# EasyEDA Pro project ProPrj_Loongson_Aquarii_v1.7.epro, board PCB1
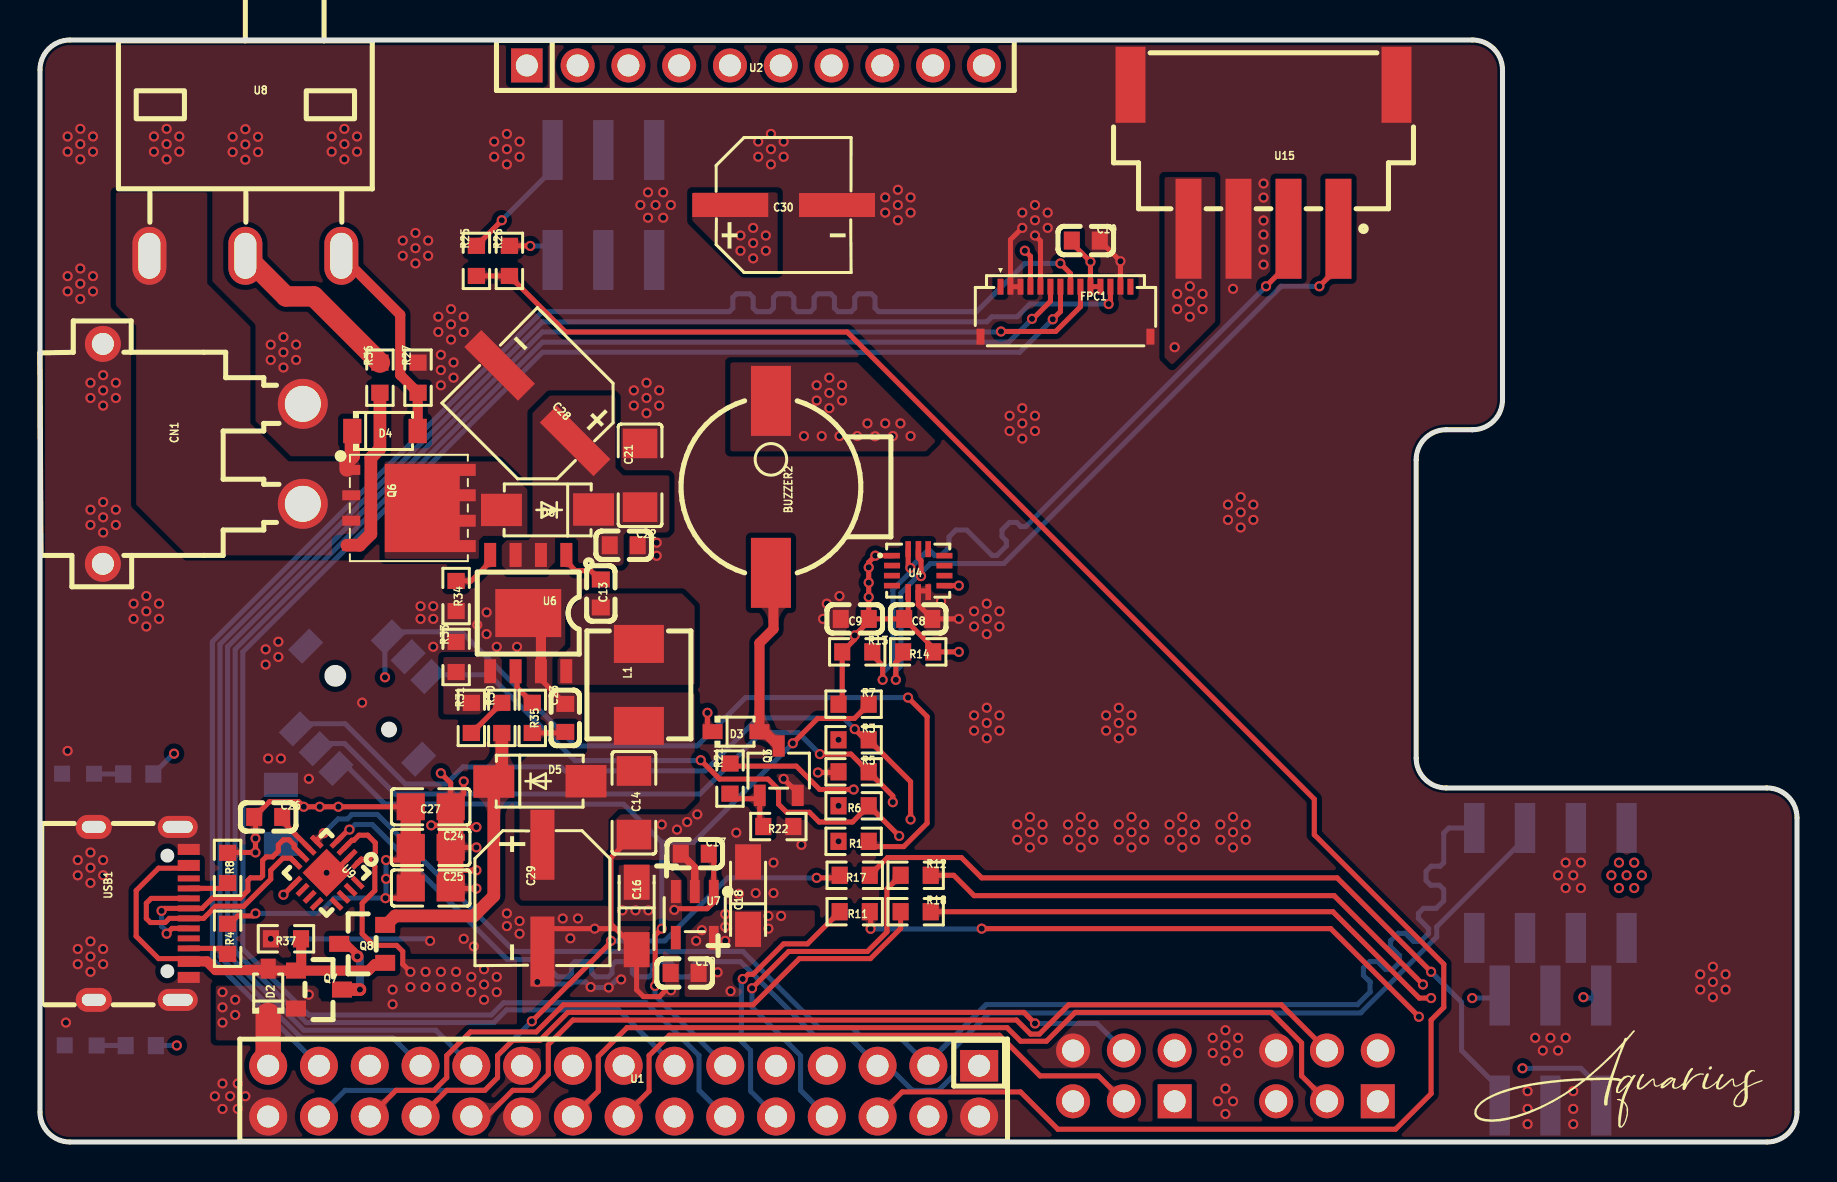
[diagram p2: board, top side]
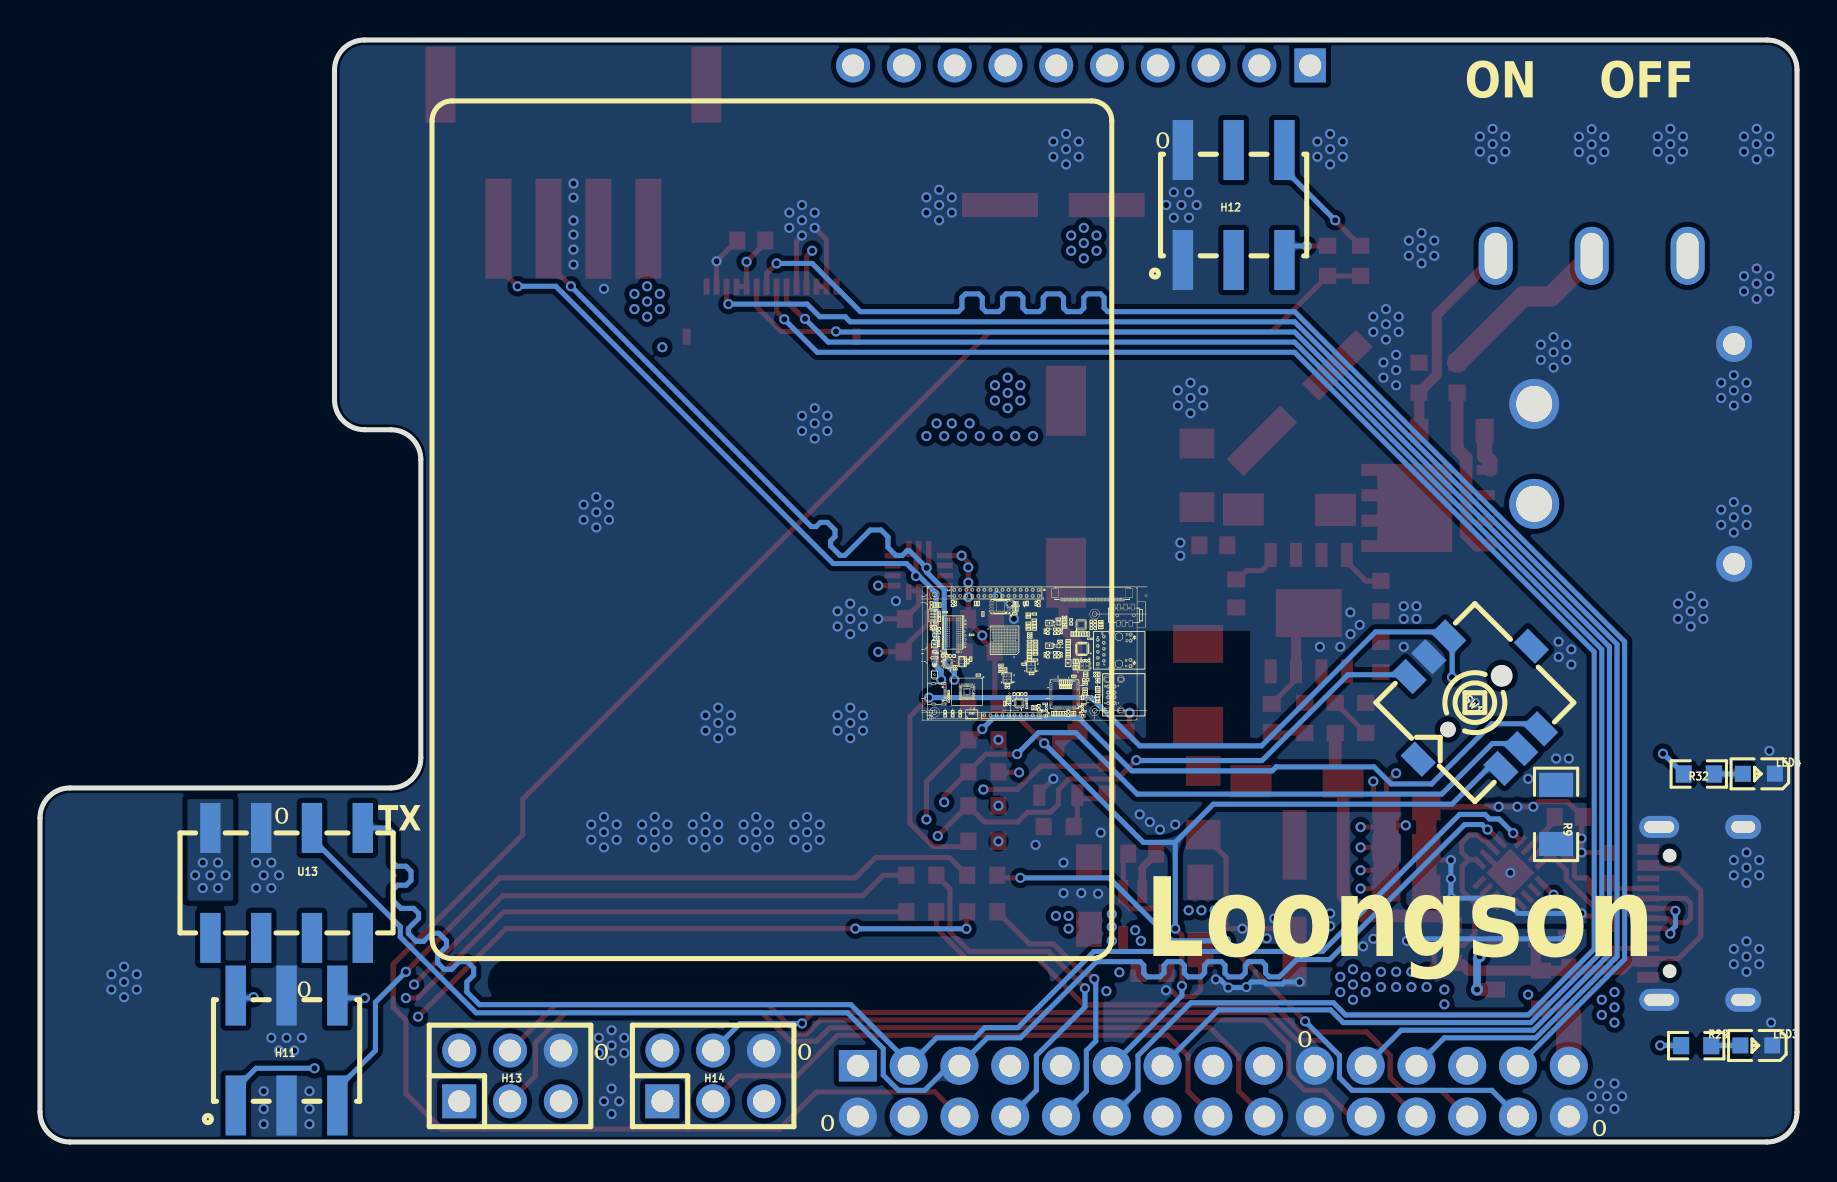
[diagram p3: board, bottom side, seen from below]

Outline 87.88 x 55.12 mm; copper layers: Top Layer, VCC, GND, Bottom Layer. Coordinates in mm from the lower left corner of the outline.
Outline path: 0,53.62 0,1.5 arc(0.44,0.44) 1.5,0 86.38,0 arc(87.44,0.44) 87.88,1.5 87.88,16.21 arc(87.44,17.27) 86.38,17.71 70.33,17.71 arc(69.27,18.15) 68.83,19.21 68.83,34.13 arc(69.27,35.19) 70.33,35.63 71.65,35.63 arc(72.71,36.07) 73.15,37.13 73.15,53.62 arc(72.71,54.68) 71.65,55.12 1.5,55.12 arc(0.44,54.68) 0,53.62
Stack: Top Layer 0.035mm 外层铜厚1oz / Dielectric1 0.2104mm 7628 RC49% 8.6mil / VCC 0.0152mm 内层铜厚 / Dielectric2 1.065mm 1.1mm H/HOZ Copper / GND 0.0152mm 内层铜厚 / Dielectric3 0.2104mm 7628 RC49% 8.6mil / Bottom Layer 0.035mm 外层铜厚1oz

## Design rules (mm)
net TX: DP2
net RX: DP2
net I2C_SCL: DP4
net I2C_SDA: DP4
net TFT180_SCL: DP3
net TFFT180_SDA: DP3
net UD+: DP1
net UD-: DP1
template: 自定义配置
spacing copperThickness1oz (default): track to track 0.102, other pairs 0.152 to 0.3
spacing copperThickness2oz: track to track 0.203, other pairs 0.152 to 0.3
track width copperThickness1oz (default): min 0.127, default 0.254, max 2.54
track width copperThickness2oz: min 0.203, default 0.254, max 2.54
differential pair differentialPair (default): width min 0.127, default 0.254, max 2.54; gap min 0.152, default 0.152
via viaSize (default): diameter min 0.5, default 0.61, max 10; hole min 0.3, default 0.305, max 6.3

## Placement (name value [footprint] x y rotation side)
BUZZER2  2.7kHz  [BUZ-SMD_GSC9032RB]  36.56 32.77 90 top
C8  10nF  [C0603]  43.93 26.17 0 top
C9  10nF  [C0603]  40.75 26.17 0 top
C10  100nF  [C0603]  52.31 45.09 180 top
C13  100nF  [C0603]  28.05 27.44 90 top
C14  47uF  [C1206]  29.71 16.97 90 top
C16  10uF  [CAP-SMD_L3.2-W1.6-RD-C7171]  29.84 11.31 270 top
C17  100nF  [C0603]  32.75 14.42 180 top
C18  10uF  [CAP-SMD_L3.2-W1.6-RD-C7171]  35.42 12.32 90 top
C19  100nF  [C0603]  32.24 8.45 180 top
C21  4.7uF  [C1206]  30.02 33.35 270 top
C22  100nF  [C0603]  29.2 29.85 180 top
C23  4.7nF  [C0603]  26.27 21.21 270 top
C24  1uF  [C0805]  19.54 14.74 180 top
C25  1uF  [C0805]  19.54 12.7 180 top
C26  100nF  [C0603]  11.41 16.26 180 top
C27  1uF  [C0805]  19.54 16.77 0 top
C28  100uF  [CAP-SMD_BD6.3-L6.6-W6.6-FD-1]  24.88 36.96 135 top
C29  220uF  [CAP-SMD_BD6.3-L6.6-W6.6-LS7.3-FD-H7.7]  25.13 12.2 270 top
C30  100uF  [CAP-SMD_BD6.3-L6.6-W6.6-FD-1]  37.2 46.87 0 top
CN1  XT30PW-M30.G.Y  [CONN-TH_XT30PW-M]  8.15 34.42 270 top
D2  1N5819WS  [SOD-323_L1.8-W1.3-LS2.5-RD]  11.41 7.5 90 top
D3  1N5819WS  [SOD-323_L1.8-W1.3-LS2.5-RD]  34.81 20.53 0 top
D4  BZT52C16  [SOD-123_L2.7-W1.6-LS3.7-RD]  17.26 35.56 0 top
D5  SS54  [SMA_L4.3-W2.6-LS5.0-FD]  25 18.04 180 top
D6  SS54  [SMA_L4.3-W2.6-LS5.0-FD]  25.39 31.63 0 top
FPC1  HC-FPC-05-09-14RLTAG  [FPC-SMD_14P-P0.50_HC-FPC-05-09-14RLTAG]  51.29 41.53 180 top
H11  HX PZ2.54-2x3P TP  [HDR-SMD_6P-P2.54-V-M-R2-C3-LS7.2_M20-8760342]  75.55 4.58 180 bottom
H12  HX PZ2.54-2x3P TP  [HDR-SMD_6P-P2.54-V-M-R2-C3-LS7.2_M20-8760342]  28.18 46.87 180 bottom
H13  PZ254V-12-6P  [HDR-TH_6P-P2.54-V-M-R2-C3-S2.54]  64.37 3.31 180 bottom
H14  PZ254V-12-6P  [HDR-TH_6P-P2.54-V-M-R2-C3-S2.54]  54.21 3.31 180 bottom
L1  4.7uH  [IND-SMD_L5.4-W5.2_FXL0530]  29.96 22.86 270 top
LED3  NCD0603R1  [LED0603-RD_RED]  2.03 4.83 0 bottom
LED4  NCD0603R1  [LED0603-RD_RED]  1.91 18.42 0 bottom
Q3  S8050  [SOT-23-3_L2.9-W1.6-P1.90-LS2.8-BR]  36.95 18.58 270 top
Q6  CJAC70P06  [TDSON-8_L5.9-W5.2-P1.27-BL]  17.34 31.71 270 top
Q7  AO3401A  [SOT-23_L2.9-W1.3-P1.90-LS2.4-BR]  13.95 7.62 180 top
Q8  AO3401A  [SOT-23_L2.9-W1.3-P1.90-LS2.4-BR]  16.11 9.91 0 top
R1  10kΩ  [R0603]  40.7 15.04 0 top
R3  10kΩ  [R0603]  40.7 20.12 180 top
R4  5.1kΩ  [R0603]  9.38 10.16 90 top
R5  10kΩ  [R0603]  40.7 18.52 180 top
R6  10kΩ  [R0603]  40.7 16.82 0 top
R7  10kΩ  [R0603]  40.7 21.9 180 top
R8  5.1kΩ  [R0603]  9.38 13.71 90 top
R9  0Ω  [R1206]  12.05 16.39 90 bottom
R11  100Ω  [R0603]  40.75 11.52 0 top
R12  100Ω  [R0603]  43.8 13.34 180 top
R13  5.1kΩ  [R0603]  40.88 24.52 180 top
R14  5.1kΩ  [R0603]  43.93 24.52 0 top
R17  100Ω  [R0603]  40.75 13.34 0 top
R18  100Ω  [R0603]  43.8 11.52 180 top
R21  1kΩ  [R0603]  34.51 18.18 270 top
R22  10kΩ  [R0603]  36.93 15.78 0 top
R25  100Ω  [R0603]  21.83 44.07 270 top
R26  100Ω  [R0603]  23.48 44.07 270 top
R27  10kΩ  [R0603]  18.91 38.23 270 top
R29  4.7kΩ  [R0603]  5.04 4.82 0 bottom
R30  51kΩ  [R0603]  23.1 21.21 270 top
R31  1.5kΩ  [R0603]  21.57 21.21 270 top
R32  2.7kΩ  [R0603]  4.91 18.41 180 bottom
R33  10kΩ  [R0603]  20.81 24.26 270 top
R34  200kΩ  [R0603]  20.81 27.31 90 top
R35  20kΩ  [R0603]  24.62 21.21 90 top
R36  10Ω  [R0603]  17 38.23 270 top
R37  10kΩ  [R0603]  12.3 10.16 0 top
SW1  7*7*5-6P-L WX  [SW-SMD_8P-L7.0-W7.0-P1.40-LS7.4-TL]  16.11 21.98 225 bottom
U1  2541FV-2x15P-B  [HDR-TH_30P-P2.54-V-F-R2-C15-S2.54]  29.2 2.54 180 top
U2  PM2.54-1*10  [HDR-TH_10P-P2.54-V-F]  35.78 53.85 0 top
U4  ICM-42688P-HXY  [LGA-14_L3.0-W2.5-P0.50-TL]  43.93 28.58 0 top
U6  SCT2450STER  [ESOP-8_L4.9-W3.9-P1.27-LS6.0-BL-EP]  24.42 26.46 180 top
U7  RT9013-33GB  [SOT-23-5_L3.0-W1.7-P0.95-LS2.8-BL]  32.75 11.37 180 top
U8  SS12D10G6-WJ  [SW-TH_3P-P4.80_HX-SS12D10G6-WJ]  10.27 44.33 180 top
U9  CH343P  [TQFN-16_L3.0-W3.0-P0.50-BL-EP1.7]  14.34 13.47 135 top
U13  5BME8-08872-204-W0  [CONN-SMD_5BME8-08872-204-W0]  75.55 12.96 0 bottom
U15  2.54-4PWTDK  [CONN-SMD_4P-P2.50_SHOU_2.54-4PWTDK]  61.2 49.28 180 top
USB1  TYPE-C 16PIN 2MD(073)  [USB-C-SMD_TYPE-C-6PIN-2MD-073]  5.06 11.44 270 top

## Footprints (pads in the part's own frame, mm; a bottom-side part is the same pattern mirrored in y, then rotated)
BUZ-SMD_GSC9032RB
  rect 3.5x2 smd: 1(4.3,0) 2(-4.3,0)
C0603
  rect 0.8x0.9 smd: 1(-0.7,0) 2(0.7,0)
C0805
  rect 1.41x1.35 smd: 1(-1,0) 2(1,0)
C1206
  rect 1.485x1.728 smd: 1(-1.593,0) 2(1.593,0)
CAP-SMD_BD6.3-L6.6-W6.6-FD-1
  rect 3.8x1.2 smd: 1(-2.67,0) 2(2.67,0)
CAP-SMD_BD6.3-L6.6-W6.6-LS7.3-FD-H7.7
  rect 3.5x1.2 smd: 1(-2.67,0) 2(2.67,0)
CAP-SMD_L3.2-W1.6-RD-C7171
  rect 1.758x1.296 smd: 1(-1.687,0) 2(1.687,0)
CONN-SMD_4P-P2.50_SHOU_2.54-4PWTDK
  rect 1.3x5 smd: 1(-3.75,3.6) 2(-1.25,3.6) 3(1.25,3.6) 4(3.75,3.6)
  rect 1.5x3.8 smd: 5(6.65,-3.6) 6(-6.65,-3.6)
CONN-SMD_5BME8-08872-204-W0
  rect 1.02x2.5 smd: 1(-3.81,-2.75) 2(-3.81,2.75) 3(-1.27,-2.75) 4(-1.27,2.75) 5(1.27,-2.75) 6(1.27,2.75) 7(3.81,-2.75) 8(3.81,2.75)
CONN-TH_XT30PW-M
  round 2.5 hole 1.8: 1(-2.5,5) 2(2.5,5)
  round 1.8 hole 1.1: 3(5.5,-5) 4(-5.5,-5)
ESOP-8_L4.9-W3.9-P1.27-LS6.0-BL-EP
  rect 0.6x1.2 smd: 1(-1.905,-2.909) 2(-0.635,-2.909) 3(0.635,-2.909) 4(1.905,-2.909) 5(1.905,2.909) 6(0.635,2.909) 7(-0.635,2.909) 8(-1.905,2.909)
  rect 3.3x2.4 smd: 9(0,0)
FPC-SMD_14P-P0.50_HC-FPC-05-09-14RLTAG
  rect 0.3x0.8 smd: 1(3.25,-1.25) 2(2.75,-1.25) 3(2.25,-1.25) 4(1.75,-1.25) 5(1.25,-1.25) 6(0.75,-1.25) 7(0.25,-1.25) 8(-0.25,-1.25) 9(-0.75,-1.25) 10(-1.25,-1.25) 11(-1.75,-1.25) 12(-2.25,-1.25) 13(-2.75,-1.25) 14(-3.25,-1.25)
  rect 0.4x0.8 smd: 15(-4.25,1.25) 16(4.25,1.25)
HDR-SMD_6P-P2.54-V-M-R2-C3-LS7.2_M20-8760342
  rect 1.02x3 smd: 1(-2.54,-2.75) 2(-2.54,2.75) 3(0,-2.75) 4(0,2.75) 5(2.54,-2.75) 6(2.54,2.75)
HDR-TH_6P-P2.54-V-M-R2-C3-S2.54
  rect 1.7x1.7 hole 1.1: 1(-2.54,-1.27)
  round 1.7 hole 1.1: 2(-2.54,1.27) 3(0,-1.27) 4(0,1.27) 5(2.54,-1.27) 6(2.54,1.27)
HDR-TH_10P-P2.54-V-F
  rect 1.575x1.7 hole 1.1: 1(-11.43,0)
  round 1.7 hole 1.1: 2(-8.89,0) 3(-6.35,0) 4(-3.81,0) 5(-1.27,0) 6(1.27,0) 7(3.81,0) 8(6.35,0) 9(8.89,0) 10(11.43,0)
HDR-TH_30P-P2.54-V-F-R2-C15-S2.54
  rect 1.9x1.575 hole 1.1: 1(-17.78,-1.27)
  round 1.9 hole 1.1: 2(-17.78,1.27) 3(-15.24,-1.27) 4(-15.24,1.27) 5(-12.7,-1.27) 6(-12.7,1.27) 7(-10.16,-1.27) 8(-10.16,1.27) 9(-7.62,-1.27) 10(-7.62,1.27) 11(-5.08,-1.27) 12(-5.08,1.27) 13(-2.54,-1.27) 14(-2.54,1.27) 15(0,-1.27) 16(0,1.27) 17(2.54,-1.27) 18(2.54,1.27) 19(5.08,-1.27) 20(5.08,1.27) 21(7.62,-1.27) 22(7.62,1.27) 23(10.16,-1.27) 24(10.16,1.27) 25(12.7,-1.27) 26(12.7,1.27) 27(15.24,-1.27) 28(15.24,1.27) 29(17.78,-1.27) 30(17.78,1.27)
IND-SMD_L5.4-W5.2_FXL0530
  rect 1.9x2.5 smd: 1(-2.05,0) 2(2.05,0)
LED0603-RD_RED
  rect 0.8x0.8 smd: 1(-0.799,-0.004) 2(0.799,0.004)
LGA-14_L3.0-W2.5-P0.50-TL
  rect 0.8x0.28 smd: 1(-1.313,0.75) 2(-1.308,0.254) 3(-1.313,-0.25) 4(-1.313,-0.75) 8(1.313,-0.75) 9(1.313,-0.25) 10(1.313,0.25) 11(1.313,0.75)
  rect 0.28x0.8 smd: 5(-0.5,-1.076) 6(0,-1.079) 7(0.5,-1.076) 12(0.5,1.076) 13(0.013,1.079) 14(-0.5,1.076)
R0603
  rect 0.806x0.864 smd: 1(-0.753,0) 2(0.753,0)
R1206
  rect 1.208x1.701 smd: 1(-1.479,0) 2(1.479,0)
SMA_L4.3-W2.6-LS5.0-FD
  rect 2.046x1.62 smd: 1(-2.304,-0.009) 2(2.304,0.009)
SOD-123_L2.7-W1.6-LS3.7-RD
  rect 0.91x1.22 smd: 1(-1.635,0) 2(1.635,0)
SOD-323_L1.8-W1.3-LS2.5-RD
  rect 1x0.75 smd: 1(-1.173,0) 2(1.173,0)
SOT-23-3_L2.9-W1.6-P1.90-LS2.8-BR
  rect 1.07x0.6 smd: 1(1.235,-0.95) 2(1.235,0.95) 3(-1.235,0)
SOT-23-5_L3.0-W1.7-P0.95-LS2.8-BL
  rect 0.49x1.157 smd: 1(-0.95,-1.153) 2(0,-1.153) 3(0.95,-1.153)
  rect 0.49x1.175 smd: 4(0.95,1.153) 5(-0.95,1.153)
SOT-23_L2.9-W1.3-P1.90-LS2.4-BR
  rect 1x0.8 smd: 1(1.15,-0.95) 2(1.15,0.95) 3(-1.15,0)
SW-SMD_8P-L7.0-W7.0-P1.40-LS7.4-TL
  rect 1.5x1 smd: 1(-3.25,1.4) 2(-3.25,0) 3(-3.25,-1.4) 4(3.25,-1.4) 5(3.25,0) 6(3.25,1.4) 7(0,4) 8(0,-4)
SW-TH_3P-P4.80_HX-SS12D10G6-WJ
  oval 1.7x2.9 hole 1.1x2.3: 1(-4.8,0) 2(0,0) 3(4.8,0)
TDSON-8_L5.9-W5.2-P1.27-BL
  rect 0.5x0.9 smd: 1(-1.905,-1.775) 2(-0.635,-1.775) 3(0.635,-1.775) 4(1.905,-1.775)
  custom 4.41x4.55 smd: 5(0,1.775)
TQFN-16_L3.0-W3.0-P0.50-BL-EP1.7
  rect 0.25x0.75 smd: 1(-0.749,-1.45) 2(-0.248,-1.45) 3(0.252,-1.45) 4(0.751,-1.45) 9(0.75,1.45) 10(0.25,1.45) 11(-0.25,1.45) 12(-0.749,1.45)
  rect 0.75x0.25 smd: 5(1.45,-0.75) 6(1.45,-0.25) 7(1.45,0.25) 8(1.45,0.75) 13(-1.45,0.75) 14(-1.45,0.25) 15(-1.45,-0.25) 16(-1.45,-0.75)
  rect 1.7x1.7 smd: 17(0.001,0)
USB-C-SMD_TYPE-C-6PIN-2MD-073
  rect 0.55x1.1 smd: 1(-3.2,2.375) 2(-2.4,2.375) 11(2.4,2.375) 12(3.2,2.375)
  rect 0.3x1.1 smd: 3(-1.75,2.375) 4(-1.25,2.375) 5(-0.75,2.375) 6(-0.25,2.375) 7(0.25,2.375) 8(0.75,2.375) 9(1.25,2.375) 10(1.75,2.375)
  oval 1.1x2 hole 0.6x1.5: 13(-4.325,1.825) 14(4.325,1.825)
  oval 1.2x1.8 hole 0.6x1.2: 13(-4.325,-2.375) 14(4.325,-2.375)

## Nets
As in the schematic.

Pads without a net: FPC1 1 14; H12 3 4; H13 1 2; H14 1 2; SW1 7 8; U1 1; U2 1 2 3 4 5 6 7 8 9 10; U4 2 3 4 9 10 11 12; U7 4; U9 10 11 12 13 14 15 16; U13 2 4 6 8; USB1 3 9

## Via types
v1: diameter 0.508, hole 0.305, Top Layer to Bottom Layer, 467 vias
v2: diameter 0.61, hole 0.305, Top Layer to Bottom Layer, 2 vias

## Routing (per net, layer and track width the routed paths; a pad name or vN(x,y) marks a point on that pad's centre or on a via; arc(x,y) is an arc through that point)
3V3: length 64.8
  Top Layer w0.254: v1(49.26,44.58) 49.54,44.3 FPC1.4 ; C8.1 44.68,24.71 R14.2 v1(45.96,24.52) ; C8.1 C9.2 ; C8.1 43.43,26.37 43.43,27.57 ; C10.2 51.61,44.96 v1(52.54,44.03) FPC1.10 FPC1.11 ; C9.2 41.45,26.04 v1(40.75,25.34) 40.75,25.14 R13.2 40.13,22.08 R7.2 ; C9.2 v1(41.45,27.26) v1(41.45,27.98) v1(41.45,28.74) 41.45,29 v1(41.78,29.33) 42.67,29.33 ; R5.2 39.91,18.48 v1(38.91,18.48) ; 45.19,27.83 v1(45.96,27.83)
  GND w0.254: v1(6.7,19.42) 6.7,22.85 11.8,27.94 40.72,27.94 41.45,27.22
  Bottom Layer w0.254: v1(6.7,19.42) 6.68,19.42 R32.1
  vias: v1(32.82,10.06) v1(33.11,10.6) v1(33.89,8.49) v1(34.27,11.4) v1(34.27,10.76) v1(34.27,10.06) v1(34.54,7.55) v1(36.43,11.31) v1(36.43,10.67) v1(37.07,11.31) v1(39.94,20.12) v1(39.94,16.82) v1(39.94,15.04) v1(56.75,39.76) v1(56.88,42.42) v1(56.88,41.66) v1(57.52,42.8) v1(57.52,42.04) v1(57.52,41.28) v1(58.15,42.42) v1(58.15,41.66)
+5V: length 35.2
  Top Layer w0.254: v1(18.53,8.51) 18.15,8.9 18.15,9.53 17.84,9.84 16.7,9.84 16.11,10.42 16.11,11.94 16.75,12.58 16.75,13.78 16.41,14.12 ; v1(21.19,18.04) 21.19,17.42 C27.2 20.54,17.95 v1(20.05,18.44) ; v1(31.73,11.61) 31.78,11.67 33.37,11.67 33.7,12 U7.1 33.7,14.17 33.45,14.42 ; C25.1 20.57,12.68 v1(21.83,12.68) ; v1(21.83,13.59) 20.54,13.59 ; D3.1 33.39,20.78 v1(33.39,21.47) ; 12.78,12.97 v1(12.18,12.37) 12.18,12.32 ; v1(21.83,14.74) C24.1 ; 20.54,15.87 20.52,15.84 v1(19.57,15.84) ; 16.41,14.12 16.05,14.12 U9.1 15.86,13.96 ; 16.41,14.12 16.77,14.48 16.77,14.97 16.39,15.35 15.95,15.35 15.7,15.09 15.61,15.09 U9.3 ; 20.54,16.02 20.81,15.75 v1(21.83,15.75)
  Top Layer w1.27: U1.29 D2.1 ; C27.2 C24.1 C25.1
  Bottom Layer w0.254: v1(6.84,4.83) 5.81,4.83 5.79,4.82
  vias: v1(9.13,7.5) v1(9.13,6.74) v1(9.13,5.97) v1(9.76,7.12) v1(9.76,6.35) v1(13.45,7.37) v1(17.64,7.62) v1(17.64,6.89) v1(18.53,7.75) v1(19.29,8.51) v1(19.29,7.75) v1(20.05,8.51) v1(20.05,7.75) v1(20.81,8.51) v1(20.81,7.75) v1(21.57,8.26) v1(21.57,7.5) v1(22.21,8.64) v1(22.21,7.88) v1(22.21,7.12) v1(22.84,8.26) v1(22.84,7.5) v1(29.13,11.59) v1(29.79,11.59) v1(30.43,11.59) v1(35.04,45.34) v1(35.04,44.58) v1(35.67,45.72) v1(35.67,44.96) v1(35.67,44.2) v1(36.31,45.34) v1(36.31,44.58) v1(38.21,35.31) v1(38.85,37.85) v1(38.85,37.09) v1(39.1,35.31) v1(39.48,38.23) v1(39.48,37.47) v1(39.48,36.71) v1(39.99,35.31) v1(40.12,37.85) v1(40.12,37.09) v1(40.88,35.31) v1(41.39,35.95) v1(41.77,35.3) v1(42.28,35.95) v1(42.66,35.31) v1(43.04,35.95) v1(43.55,35.31) v1(78.6,13.34) v1(78.98,13.97) v1(78.98,12.7) v1(79.36,13.34) v1(79.74,13.97) v1(79.74,12.7) v1(80.12,13.34)
AGND: length 29.7
  Top Layer w0.254: v1(17.28,12.2) 18.03,12.2 C25.2 ; v1(10.78,11.44) 10.65,11.31 9.89,11.31 9.5,10.92 R4.2 ; R8.2 9.4,14.48 v1(10.78,14.48) v1(10.78,15.19) 10.78,16.2 C26.2 11.48,17.02 12.94,17.02 v1(13.19,16.77) v1(13.99,16.77) v1(14.93,16.77) C27.1 ; 14.84,13.47 14.84,13.62 15.54,14.32 ; 18.54,14.01 18.45,14.1 v1(17.31,14.1)
  Top Layer w1.016: C27.1 C24.2 C25.2
  Bottom Layer w0.254: v1(10.78,11.44) 13.95,11.44 14.72,12.2 v1(17.28,12.2) 17.31,12.23 v1(17.31,13.16) v1(17.31,14.1)
  vias: v1(14.34,13.47)
GND: length 49.5
  Top Layer w0.254: v1(49.13,45.72) 48.54,45.13 FPC1.2 FPC1.3 ; U6.7 25.06,23.13 C23.1 ; v1(45.96,26.17) C8.2 43.93,26.87 43.93,27.57 44.43,27.57 ; v1(11.54,10.16) R37.1 11.56,10.16 ; 28.79,10.67 C16.2 29.84,7.61 30.18,7.27 30.99,7.27 31.3,7.59 v1(31.56,7.59) ; 28.79,10.67 v1(27.74,10.67) 25.13,10.67 25.13,9.4 ; 28.79,10.67 28.56,10.9 28.56,14.23 C14.1 ; FPC1.5 50.04,45.07 v1(49.77,45.34) ; FPC1.13 v1(54.04,44.06) C10.1 ; v1(37.2,18.17) 37.9,17.46 Q3.2
  Top Layer w0.381: C17.2 32.75,13.72 U7.2
  Top Layer w0.508: U6.9 25.06,25.82 U6.7
  Bottom Layer w0.254: v1(11.54,10.16) 19.41,10.16 v1(19.51,10.06) ; v1(24.88,8.01) 25.64,8.01 25.75,7.9 26.55,7.9 26.65,8.01 27.29,8.01 v1(27.54,7.75) 27.57,7.73 v1(28.45,7.73) 28.85,8.13 v1(29.07,8.13)
  vias: v1(1.3,5.97) v1(1.38,50.3) v1(1.38,49.53) v1(1.38,43.31) v1(1.38,42.55) v1(1.38,19.56) v1(1.89,14.1) v1(1.89,13.34) v1(1.89,9.66) v1(1.89,8.9) v1(2.02,50.68) v1(2.02,49.92) v1(2.02,49.15) v1(2.02,43.69) v1(2.02,42.93) v1(2.02,42.17) v1(2.52,37.98) v1(2.52,37.22) v1(2.52,31.63) v1(2.52,30.87) v1(2.52,14.48) v1(2.52,13.72) v1(2.52,12.96) v1(2.52,10.04) v1(2.52,9.28) v1(2.52,8.51) v1(2.65,50.3) v1(2.65,49.53) v1(2.65,43.31) v1(2.65,42.55) v1(3.16,38.36) v1(3.16,37.6) v1(3.16,36.83) v1(3.16,32.01) v1(3.16,31.25) v1(3.16,30.48) v1(3.16,14.1) v1(3.16,13.34) v1(3.16,9.66) v1(3.16,8.9) v1(3.79,37.98) v1(3.79,37.22) v1(3.79,31.63) v1(3.79,30.87) v1(4.68,26.93) v1(4.68,26.17) v1(5.32,27.31) v1(5.32,26.55) v1(5.32,25.79) v1(5.7,50.3) v1(5.7,49.53) v1(5.95,26.93) v1(5.95,26.17) v1(6.33,50.68) v1(6.33,49.92) v1(6.33,49.15) v1(6.97,50.3) v1(6.97,49.53) v1(8.75,2.29) v1(9.13,2.93) v1(9.13,1.66) v1(9.51,2.29) v1(9.64,50.28) v1(9.64,49.52) v1(9.89,2.93) v1(9.89,1.66) v1(10.27,50.66) v1(10.27,49.9) v1(10.27,49.14) v1(10.27,2.29) v1(10.91,50.28) v1(10.91,49.52) v1(11.29,24.64) v1(11.29,23.88) v1(11.41,19.18) v1(11.54,39.88) v1(11.54,39.12) v1(11.92,25.02) v1(11.92,24.26) v1(12.05,19.18) v1(12.18,40.26) v1(12.18,39.5) v1(12.18,38.74) v1(12.81,39.88) v1(12.81,39.12) v1(13.45,18.17) v1(14.59,50.3) v1(14.59,49.53) v1(15.22,50.68) v1(15.22,49.92) v1(15.22,49.15) v1(15.86,50.3) v1(15.86,49.53) v1(16.11,21.98) v1(18.15,45.09) v1(18.15,44.33) v1(18.78,45.47) v1(18.78,44.71) v1(18.78,43.95) v1(19.03,26.8) v1(19.03,26.17) v1(19.42,45.09) v1(19.42,44.33) v1(19.67,26.8) v1(19.67,26.17) v1(19.67,24.77) v1(19.92,41.28) v1(19.92,40.52) v1(20.05,39.38) v1(20.05,38.61) v1(20.05,37.85) v1(20.56,41.66) v1(20.56,40.9) v1(20.56,40.14) v1(20.69,38.99) v1(20.69,38.23) v1(21.19,41.28) v1(21.19,40.52) v1(21.19,10.16) v1(21.7,9.78) v1(21.87,25.87) v1(22.34,26.49) v1(22.34,25.41) v1(22.72,50.04) v1(22.72,49.28) v1(22.84,24.77) v1(23.35,50.42) v1(23.35,49.66) v1(23.35,48.9) v1(23.35,11.44) v1(23.35,10.8) v1(23.86,24.77) v1(23.99,50.04) v1(23.99,49.28) v1(23.99,11.05) v1(23.99,10.42) v1(26.15,11.18) v1(26.53,10.19) v1(26.91,11.18) v1(29.7,37.6) v1(29.7,36.83) v1(30.03,46.87) v1(30.34,37.98) v1(30.34,37.22) v1(30.34,36.45) v1(30.41,47.5) v1(30.41,46.23) v1(30.79,46.87) v1(30.85,29.98) v1(30.85,29.32) v1(30.97,37.6) v1(30.97,36.83) v1(31.17,47.5) v1(31.17,46.23) v1(31.1,15.88) v1(31.55,46.87) v1(31.86,15.63) v1(32.37,16.01) v1(32.88,16.39) v1(34.83,15.47) v1(34.96,12.42) v1(35.8,12.45) v1(35.93,50.04) v1(35.93,49.28) v1(36.56,50.42) v1(36.56,49.66) v1(36.56,48.9) v1(36.69,13.97) v1(36.69,12.45) v1(37.2,50.04) v1(37.2,49.28) v1(38.08,14.86) v1(39.17,26.17) v1(39.36,26.93) v1(39.99,27.31) v1(42.28,47.25) v1(42.28,46.49) v1(42.91,47.63) v1(42.91,46.87) v1(42.91,46.11) v1(43.55,47.25) v1(43.55,46.49) v1(45.07,27.06) v1(46.72,26.55) v1(46.72,25.79) v1(46.72,21.34) v1(46.72,20.58) v1(47.36,26.93) v1(47.36,26.17) v1(47.36,25.41) v1(47.36,21.72) v1(47.36,20.96) v1(47.36,20.2) v1(47.99,26.55) v1(47.99,25.79) v1(47.99,21.34) v1(47.99,20.58) v1(48.5,36.33) v1(48.5,35.56) v1(48.88,15.88) v1(48.88,15.12) v1(49.13,46.49) v1(49.13,36.71) v1(49.13,35.95) v1(49.13,35.18) v1(49.52,16.26) v1(49.52,15.5) v1(49.52,14.74) v1(49.77,46.87) v1(49.77,46.11) v1(49.77,36.33) v1(49.77,35.56) v1(50.15,15.88) v1(50.15,15.12) v1(50.4,46.49) v1(50.4,45.72) v1(51.42,15.88) v1(51.42,15.12) v1(52.05,16.26) v1(52.05,15.5) v1(52.05,14.74) v1(52.69,15.88) v1(52.69,15.12) v1(53.33,21.34) v1(53.33,20.58) v1(53.96,21.72) v1(53.96,20.96) v1(53.96,20.2) v1(53.96,15.88) v1(53.96,15.12) v1(54.59,21.34) v1(54.59,20.58) v1(54.59,16.26) v1(54.59,15.5) v1(54.59,14.74) v1(55.23,15.88) v1(55.23,15.12) v1(56.5,15.88) v1(56.5,15.12) v1(57.14,16.26) v1(57.14,15.5) v1(57.14,14.74) v1(57.77,15.88) v1(57.77,15.12) v1(58.66,5.21) v1(58.66,4.45) v1(58.91,2.04) v1(59.04,15.88) v1(59.04,15.12) v1(59.29,5.59) v1(59.29,4.83) v1(59.29,4.07) v1(59.29,2.67) v1(59.29,1.4) v1(59.42,31.88) v1(59.42,31.12) v1(59.67,42.68) v1(59.67,16.26) v1(59.67,15.5) v1(59.67,14.74) v1(59.67,2.04) v1(59.93,5.21) v1(59.93,4.45) v1(60.06,32.26) v1(60.06,31.5) v1(60.06,30.74) v1(60.31,15.88) v1(60.31,15.12) v1(60.69,31.88) v1(60.69,31.12) v1(61.2,47.94) v1(61.2,47.24) v1(61.2,46.09) v1(61.2,45.39) v1(61.2,44.64) v1(61.2,43.89) v1(74.41,2.54) v1(74.41,1.66) v1(74.41,0.89) v1(74.79,5.21) v1(75.17,4.58) v1(75.55,5.21) v1(75.93,13.34) v1(75.93,4.58) v1(76.31,13.97) v1(76.31,12.7) v1(76.31,5.21) v1(76.69,13.34) v1(76.69,2.54) v1(76.69,1.66) v1(76.69,0.89) v1(77.07,13.97) v1(77.07,12.7) v1(83.04,8.39) v1(83.04,7.62) v1(83.68,8.77) v1(83.68,8.01) v1(83.68,7.24) v1(84.31,8.39) v1(84.31,7.62)
VCCBAT_5V: length 14.5
  Top Layer w0.635: 17.11,10.86 17.32,10.86 17.77,11.31 21.7,11.31 22.7,12.31 D5.2 23.1,18.43 R30.2
VCCUSB: length 20.3
  Top Layer w0.254: USB1.2 7.3,13.7 5.93,13.7 4.81,12.58 4.81,10.29 5.93,9.17 6.94,9.17 7.08,9.03 USB1.11
  Top Layer w0.508: 17.11,8.96 17.05,8.9 16.75,8.9 16.43,8.57 13.08,8.57 ; 13.08,8.57 13.07,8.59 13.07,10.16 ; 13.08,8.57 11.51,8.57 D2.2 11.35,8.6 8.78,8.6 8.35,9.03 USB1.11
BUZZER: length 68.7
  Top Layer w0.254: v1(40.7,17.63) 39,17.63 37.83,18.8 34.64,18.8 34.51,18.68
  GND w0.254: U1.4 45.83,2.67 50.15,2.67 50.78,3.31 67.68,3.31 68.44,4.07 68.44,9.91 60.69,17.66 40.72,17.66 v1(40.7,17.63)
ENCODER_DIR_L: length 44.3
  Top Layer w0.254: H13.3 63.1,3.31 63.1,4.96 61.58,6.48 51.78,6.48 50.34,5.04 49.05,5.04 48.37,5.72 29.36,5.72 27.92,4.28 27.92,2.54 26.65,1.28
ENCODER_DIR_R: length 29.1
  Top Layer w0.254: H14.3 52.94,3.31 50.02,3.31 47.99,5.34 31.48,5.34 30.46,4.32 30.46,2.54 U1.16
ENCODER_PWM_L: length 47.5
  Top Layer w0.254: H13.4 62.09,6.86 51.45,6.86 49.99,5.4 49.55,5.4 48.84,6.1 26.65,6.1 25.43,4.87 25.43,3.39 24.62,2.59 23.65,2.59 22.34,1.28 U1.22
ENCODER_PWM_R: length 38.8
  Top Layer w0.254: U1.24 20.35,2.59 22.25,2.59 22.89,3.22 22.89,4.32 23.65,5.09 25,5.09 26.4,6.48 49.22,6.48 v1(49.77,5.93)
  Bottom Layer w0.254: v1(49.77,5.93) 52.86,5.93 H14.4
GOVERNOR: length 100.1
  Top Layer w0.254: U1.6 43.12,2.5 49.05,2.5 50.91,0.64 67.8,0.64 69.58,2.42 69.58,6.1 70.22,6.74 70.22,8.9 63.74,15.37 63.74,17.15 40.37,40.52 26.28,40.52 R26.2 R25.2
I2C_SCL: length 63.8
  Top Layer w0.254: 43.93,29.59 43.93,29.22 44.07,29.08 v1(44.07,28.31) ; v1(42.81,23.12) 42.81,23.98 43.17,24.35 R14.1 ; v1(63.99,42.8) 64.95,43.76 U15.1
  GND w0.254: U1.15 28.13,4.88 28.13,5.14 30.11,7.12 30.11,8.35 42.81,21.05 v1(42.81,23.12) 42.8,23.12
  Bottom Layer w0.254: v1(42.81,23.12) 42.81,23.56 43.06,23.82 43.06,27.46 43.91,28.31 44.02,28.31 44.02,28.42 44.54,28.94 48.21,28.94 62.08,42.8 v1(63.99,42.8) ; v1(44.07,28.31) 44.03,28.31
I2C_SDA: length 63.9
  Top Layer w0.254: U15.2 62.45,43.93 v1(61.33,42.8) ; R13.1 41.63,24.35 42.15,23.83 v1(42.15,23.12) ; 43.43,29.59 43.43,28.83 v1(43.54,28.72)
  GND w0.254: v1(42.15,23.12) 42.15,20.97 29.7,8.52 29.7,7.28 27.72,5.3 27.72,4.88 26.65,3.81
  Bottom Layer w0.254: v1(61.33,42.8) 49.31,30.79 49.05,30.79 48.85,30.99 48.5,30.99 48.12,30.61 48.12,30.29 48.34,30.07 48.34,29.81 47.86,29.34 47.62,29.34 46.36,30.61 45.81,30.61 45.47,30.27 45.47,29.74 45.07,29.34 44.75,29.34 44.52,29.57 44.39,29.57 v1(43.54,28.72) 43.54,28.51 42.66,27.63 42.66,23.99 42.15,23.48 v1(42.15,23.12)
KEY_DOWN: length 43.8
  Top Layer w0.254: v1(37.65,19.94) 38.9,21.19 40.74,21.19 R7.1 ; v1(31.1,10.67) 30.77,10.34 30.77,8.63 30.77,8.62 v1(30.77,7.81)
  Bottom Layer w0.254: U1.11 30.77,7.32 v1(30.77,7.81) ; v1(31.1,10.67) 31.1,14.99 ; 31.1,14.99 32.7,14.99 v1(37.65,19.94) ; 31.1,14.99 29.2,16.9 17.26,16.9 15.46,18.69 SW1.4
KEY_LEFT: length 42.1
  Top Layer w0.254: v1(42.97,15.31) 41.46,16.82 R6.2 40.64,16.01 38.97,16.01 38.49,16.49 37.35,16.49 36.94,16.9 36.94,17.63 36.41,18.15 33.99,18.15 v1(33.05,19.1)
  GND w0.254: U1.9 36.81,8.9 42.97,15.05 v1(42.97,15.31)
  Bottom Layer w0.254: 19.4,23.28 19.49,23.37 22.46,23.37 26.76,19.08 33.03,19.08 v1(33.05,19.1)
KEY_MID: length 53.5
  Top Layer w0.254: v1(42.66,17) 42.66,17.31 R5.1 40.56,19.4 v1(39.01,19.4)
  GND w0.254: v1(42.66,17) 42.66,15.75 35.6,8.69 34.93,8.69 33,6.76 33,2.54 U1.14
  Bottom Layer w0.254: v1(39.01,19.4) 37.93,20.48 36.08,20.48 33,17.4 17.77,17.4 15.24,19.93 14.07,19.93 13.82,19.68
KEY_RIGHT: length 52.6
  Top Layer w0.254: v1(43.55,16.13) 43.55,18.02 R3.1 41.29,20.12 v1(40.75,20.65)
  GND w0.254: U1.7 37.32,5.85 37.32,8.64 43.55,14.86 v1(43.55,16.13)
  Bottom Layer w0.254: v1(40.75,20.65) 40.19,21.21 35.93,21.21 33.28,18.57 26.25,18.57 26.05,18.77 21.16,18.77 20.3,17.91 18.27,17.91 15.26,20.92 13.28,20.92 13.03,20.67 SW1.6
KEY_UP: length 61.6
  Top Layer w0.254: v1(43.42,22.23) 44.37,21.28 44.37,15.94 43.2,14.78 41.71,14.78 R1.2
  GND w0.254: v1(17.26,23.25) 17.13,23.25 16.65,22.77 16.65,4.1 16.49,3.94 U1.25
  Bottom Layer w0.254: v1(17.26,23.25) 17.25,23.25 17.25,25.09 17.42,25.26 17.68,25.52 21.08,25.52 26.78,19.82 32.88,19.82 35.29,22.23 v1(43.42,22.23)
MOTOR_DIR_L: length 19
  Top Layer w0.254: v1(35.62,7.69) 35.62,7.7 37.45,9.53 41.39,9.53 42.36,10.51 42.36,12.66 R12.2
  Bottom Layer w0.254: v1(35.62,7.69) 35.62,6.75 38.04,4.32 38.04,2.59 U1.8
MOTOR_DIR_R: length 13.9
  Top Layer w0.254: R11.1 38.39,9.91 37.2,9.91 35.67,8.39 35.42,8.39 35.19,8.16 v1(35.15,8.16)
  Bottom Layer w0.254: U1.10 35.55,2.54 35.55,4.57 35.08,5.04 35.08,7.92 35.15,7.99 v1(35.15,8.16)
MOTOR_PWM_L: length 31.9
  Top Layer w0.254: R18.2 43.05,10.68 41.54,9.17 37.98,9.17 35.67,6.86 26.18,6.86 24.82,5.51 21.53,5.51 20.35,4.32 20.35,3.22 19.71,2.59 17.81,2.59 U1.26
MOTOR_PWM_R: length 31.7
  Top Layer w0.254: R17.1 39.87,13.21 v1(38.85,13.21) ; v1(28.56,10.06) 28.56,10 v1(24.6,6.04)
  Bottom Layer w0.254: U1.28 15.27,2.59 22.25,2.59 22.89,3.22 22.89,4.32 23.61,5.04 ; v1(28.56,10.06) 31.25,10.06 34.4,13.21 v1(38.85,13.21) ; v1(24.6,6.04) 23.61,5.04
RX: length 76.3
  Top Layer w0.254: v1(15.48,15.63) 15.43,15.63 U9.4
  Bottom Layer w0.254: v1(15.48,15.63) 15.5,15.63 15.76,15.88 16.62,15.88 23.38,9.12 25.03,9.12 25.89,8.26 26.4,8.26 26.58,8.44 26.58,8.84 26.76,9.02 27.42,9.02 27.6,8.84 27.6,8.46 27.8,8.26 28.43,8.26 28.61,8.44 28.61,8.84 28.79,9.02 29.45,9.02 29.63,8.84 29.63,8.46 29.83,8.26 30.46,8.26 30.64,8.44 30.64,8.84 30.82,9.02 31.48,9.02 31.66,8.84 31.66,8.46 31.86,8.26 32.5,8.26 32.68,8.44 32.68,8.84 32.86,9.02 35.04,9.02 38.85,5.21 40.5,5.21 U1.5 42.4,3.81 43.63,2.59 44.94,2.59 45.7,3.35 45.7,4.68 47.49,6.46 66.07,6.46 69.86,10.26 69.86,10.77 74.28,15.18 U13.3
TFFT180_SDA: length 80.5
  Top Layer w0.254: FPC1.8 51.54,43.44 v1(51.04,43.95)
  Bottom Layer w0.254: v1(51.04,43.95) 49.26,43.95 46.85,41.53 41.95,41.53 41.77,41.71 41.77,42.24 41.59,42.42 40.93,42.42 40.75,42.24 40.75,41.71 40.57,41.53 39.92,41.53 39.74,41.71 39.74,42.24 39.56,42.42 38.9,42.42 38.72,42.24 38.72,41.71 38.54,41.53 37.88,41.53 37.7,41.71 37.7,42.24 37.52,42.42 36.87,42.42 36.69,42.24 36.69,41.71 36.51,41.53 35.85,41.53 35.67,41.71 35.67,42.24 35.49,42.42 34.84,42.42 34.66,42.24 34.66,41.71 34.48,41.53 25.13,41.53 8.62,25.02 8.62,9.15 U1.27
TFT180_CS: length 80.3
  Top Layer w0.254: v1(53.45,41.91) 53.54,42.01 FPC1.12
  Bottom Layer w0.254: U1.23 17.64,5.21 13.06,5.21 9,9.27 9,24.9 25.13,41.03 47.36,41.03 47.61,41.28 48.88,41.28 49.52,41.91 v1(53.45,41.91)
TFT180_DC: length 93.2
  Top Layer w0.254: FPC1.7 51.04,41.54 v1(50.66,41.15)
  Bottom Layer w0.254: U1.12 32.96,2.59 32.96,4.32 30.32,6.97 23.19,6.97 22.58,6.35 13.44,6.35 10.14,9.65 10.14,24.52 25.13,39.5 49.01,39.5 v1(50.66,41.15)
TFT180_RES: length 88.7
  Top Layer w0.254: FPC1.6 50.54,42.05 49.66,41.17 v1(49.62,41.17)
  Bottom Layer w0.254: U1.13 28.94,6.61 23.33,6.61 22.7,5.97 13.32,5.97 9.76,9.53 9.76,24.64 25.13,40.01 48.45,40.01 v1(49.62,41.17)
TFT180_SCL: length 80.6
  Top Layer w0.254: FPC1.9 52.04,41.78 50.8,40.54 v1(48.07,40.54)
  Bottom Layer w0.254: U1.21 19.8,5.59 13.19,5.59 9.38,9.4 9.38,24.77 25.13,40.52 48.04,40.52 v1(48.07,40.54)
TX: length 76.4
  Top Layer w0.254: 13.84,15.02 13.84,15.09 v1(14.2,15.45)
  Bottom Layer w0.254: v1(14.2,15.45) 14.91,16.16 15.38,16.16 15.61,16.39 16.88,16.39 23.73,9.53 35.16,9.53 38.97,5.72 40.62,5.72 41.13,5.21 43.04,5.21 U1.3 44.43,3.98 47.32,6.87 65.9,6.87 66.53,7.5 66.53,8.01 66.19,8.35 66.19,8.7 66.51,9.02 66.91,9.02 67.3,8.64 67.67,8.64 68,8.97 68,9.33 67.55,9.78 67.55,10.06 67.93,10.44 68.29,10.44 68.69,10.04 69.07,10.04 69.46,10.43 69.46,10.68 68.95,11.19 68.95,11.44 69.2,11.69 69.83,11.69 70.21,12.07 70.21,12.63 70,12.85 69.57,12.85 69.33,13.09 69.33,13.54 69.58,13.8 70.04,13.8 70.21,13.97 70.21,15.45 70.47,15.71 U13.1
UD+: length 12.3
  Top Layer w0.254: v1(6.08,11.56) 6.2,11.69 USB1.6 8.11,11.69 8.62,12.2 10.02,12.2 10.4,12.58 10.4,13.09 10.53,13.21 11.03,13.21 11.14,13.31 11.14,14.08 11.31,14.26 11.64,14.26 11.92,14.55 11.92,14.86 12.18,15.12 12.46,15.12 12.71,14.86 12.71,14.74 U9.7 ; USB1.8 6.6,10.69 v1(6.33,10.42)
  Bottom Layer w0.254: v1(6.08,11.56) 6.08,10.8 6.33,10.55 v1(6.33,10.42)
UD-: length 12.2
  Top Layer w0.254: 12.78,13.96 12.55,14.2 12.14,14.2 11.54,13.59 11.54,13.15 10.19,11.79 8.79,11.79 8.18,11.19 USB1.7 6.47,11.19 6.26,10.98 5.52,10.98 5.32,11.18 5.32,11.94 5.56,12.19 USB1.5
$1N4144: length 2
  Top Layer w0.762: 15.35,33.66 15.35,34.04 15.62,34.31 D4.1
$1N4169: length 10.4
  Top Layer w0.508: D4.2 18.89,37.46 R27.2 18.02,38.37 18.02,41.38 U8.1
$1N4273: length 36.1
  Top Layer w0.254: R12.1 45.7,13.34 46.72,12.32 64.73,12.32 v1(69.17,7.88)
  GND w0.254: v1(77.2,7.24) 72.5,7.24 71.87,7.88 v1(69.17,7.88)
  Bottom Layer w0.254: 78.09,7.2 77.24,7.2 v1(77.2,7.24)
$1N4282: length 2.1
  Top Layer w0.254: USB1.10 9.11,9.69 R4.1
$1N4283: length 2.1
  Top Layer w0.254: R8.1 9.11,12.69 USB1.4
$1N4817: length 9.4
  Top Layer w0.508: 36.69,28.27 36.69,25.66 35.99,24.96 35.99,20.4 36.36,20.4 Q3.3
$1N4974: length 3.1
  Top Layer w0.254: 34.51,17.17 35.83,17.17 36,17.34 36,16.09 36.18,15.91
$1N5665: length 3.7
  Top Layer w0.381: v2(15.88,9.29) 15.88,9.37 15.34,9.91 15.11,9.91
  Top Layer w0.635: v2(16,7.62) 15.08,7.62
  Bottom Layer w0.381: v2(15.88,9.29) 16,9.16 v2(16,7.62)
$1N14385: length 41.7
  Top Layer w0.254: R11.2 41.55,11.48 v1(41.55,10.66) ; v1(68.97,6.27) 64.56,10.67 v1(47.1,10.67)
  GND w0.254: v1(74.15,3.69) 71.99,3.69 69.42,6.27 v1(68.97,6.27)
  Bottom Layer w0.254: v1(41.55,10.66) 47.09,10.66 v1(47.1,10.67) ; v1(74.15,3.69) 77.07,3.69 78.09,2.67 78.09,1.7
$1N14395: length 30.2
  Top Layer w0.254: v1(69.58,7.2) 68.99,7.2 64.67,11.52 R18.1
  GND w0.254: v1(71.64,7.2) v1(69.58,7.2)
  Bottom Layer w0.254: 73.01,7.2 v1(71.64,7.2)
$1N14409: length 39
  Top Layer w0.254: R17.2 42.39,14.23 46.09,14.23 47.1,13.21 64.88,13.21 v1(69.58,8.51)
  Bottom Layer w0.254: 73.01,1.7 73.01,2.67 71.11,4.58 71.11,6.99 v1(69.58,8.51)
$1N14553: length 6.4
  Top Layer w0.254: R25.1 23.1,46.1 v1(23.1,46.11)
  Bottom Layer w0.254: H12.6 25.64,48.65 v1(23.1,46.11)
$1N14558: length 2.7
  Top Layer w0.254: v1(24.52,44.82) 24.52,44.83 R26.1
  Bottom Layer w0.254: v1(24.52,44.82) 25.4,44.82 25.64,44.58 H12.5
$1N22821: length 8.9
  Top Layer w1.016: R36.1 13.69,42.3 12.3,42.3 U8.2
$1N23425: length 2.2
  Top Layer w0.254: C26.1 12.11,16.04 U9.6
$1N29256: length 1.5
  Bottom Layer w0.254: R29.1 4.28,4.83 LED3.2
$1N41370: length 8.7
  Top Layer w0.635: 15.35,29.85 15.99,29.85 16.55,30.41 16.55,34.22 17,34.68 R36.2
$2N1741: length 2.4
  Top Layer w0.254: U6.4 22.52,29.01 21.57,28.06 R34.2
$2N1743: length 2.4
  Top Layer w0.254: U6.1 26.33,29.03 26.78,28.58 27.54,28.58 27.99,28.14 C13.2
$2N1746: length 1.7
  Top Layer w0.254: R35.1 26.22,20.46 C23.2
$2N1747: length 1.9
  Top Layer w0.254: U6.6 23.86,23.48 23.86,22.74 24.62,21.98 R35.2
$2N1753: length 2.1
  Top Layer w0.254: R31.2 21.59,20.46 R30.1
$2N1757: length 1.5
  Bottom Layer w0.254: LED4.2 2.72,18.41 R32.2

## Copper pours and planes (outline as drawn; the poured copper is in the pictures)
3V3 on Top Layer: 32.24,7.25 32.24,10.29 33.54,11.59 38.75,11.59 38.75,10.03 36.69,10.03 36.69,9.17 34.91,7.25
3V3 on Top Layer: 56.25,48.27 56.25,39.25 56.63,38.87 58.79,41.03 58.79,48.26 58.78,48.27
3V3 on VCC: 31.48,48.96 69.46,48.96 69.46,0.26 31.48,0.26
+5V on Top Layer: 28.69,13.85 31.35,13.85 32.12,13.09 32.12,11.05 28.94,11.05 28.69,11.31
+5V on Top Layer: 34.53,38.99 34.53,34.55 44.31,34.55 44.82,35.06 40.88,38.99
+5V on Top Layer: 23.86,5.15 14.06,5.15 14.06,5.09 8.79,5.09 8.79,7.82 13.74,7.82 13.94,7.62 13.94,7.26 14.06,7.13 14.06,7.04 16.62,7.04 16.62,8.13 17,8.51 17.89,8.51 18.02,8.64 18.02,9.02 18.15,9.15 23.86,9.15
+5V on Top Layer: 32.62,47.5 32.62,46.08 35.21,43.49 36.89,43.49 36.89,47.5 36.89,47.5
+5V on Bottom Layer: 78.22,17.15 80.5,17.15 80.5,12.07 78.22,12.07
+5V on VCC: 0.26,54.87 87.63,54.87 87.63,0.26 0.26,0.26
AGND on Bottom Layer: 10.33,16.97 18.86,16.97 19.54,16.29 19.54,11.94 19.42,11.82 17.64,11.82 16.74,10.92 10.26,10.92 10.26,16.9
AGND on GND: 8.62,16.26 8.62,10.42 8.87,10.16 10.53,10.16 11.36,11 14.5,11 15.19,11.69 19.29,11.69 19.29,17.53 9.89,17.53
AGND on GND: 17.17,11.91 17.26,11.82 19.54,11.81 19.54,17.66 19.42,17.78 17.26,17.78 17.17,17.69
GND on Top Layer: 18.65,27.06 21.87,27.06 22.63,27.82 26.02,27.82 26.15,27.69 26.15,25.03 24.75,25.03 24.24,24.52 18.65,24.52
GND on Top Layer: -1.03,56.14 88.89,56.14 88.89,-0.88 -1.03,-0.88
GND on Bottom Layer: -0.78,56.65 89.27,56.65 89.27,-2.03 -0.78,-2.03
GND on GND: -0.9,55.76 89.14,55.76 89.14,-1.27 -0.9,-1.27
VCCBAT on Top Layer: 17.24,34.04 22.97,34.04 24.5,32.52 24.5,30.32 22.17,30.32 21.96,30.1 21.96,29.17 17.24,29.17
$1N4144 on Top Layer: 4.81,31.88 4.81,40.82 3.79,41.84 3.79,47.5 8.37,47.5 8.37,42.94 10.53,40.78 10.53,35.96 12.44,34.05 15.99,34.05 15.99,29.34 7.35,29.34
$2N1742 on Top Layer: 25.51,37.34 28.7,37.34 28.79,37.25 28.79,33.72 29.16,33.35 31.41,33.35 31.48,33.28 31.48,30.61 31.35,30.48 29.32,30.48 29.2,30.36 29.2,28.96 29.07,28.83 27.04,28.83 26.91,28.96 26.91,30.07 26.75,30.23 25.77,30.23 25.77,29.01 25.27,28.51 23.43,28.51 23.1,28.83 23.1,29.85 23.35,30.1 24.42,30.1 24.64,30.32 24.64,36.47
$2N1744 on Top Layer: 26.53,24.77 26.53,26.67 27.3,27.44 32.12,27.44 32.75,26.8 32.75,22.86 25.88,22.86 25.88,24.13
$2N1748 on Top Layer: 20.18,24.26 22.97,24.26 23.1,24.13 23.1,22.82 22.88,22.6 22.44,22.6 22.44,21.7 22.13,21.38 20.18,21.38
$2N1752 on Top Layer: 24.42,19.35 27.17,19.35 27.36,19.53 27.36,22.42 27.42,22.48 32.62,22.48 32.75,22.36 32.75,17.15 32.24,16.64 28.94,16.64 28.43,16.13 28.43,12.07 24.11,12.07 23.99,12.2 23.99,18.91

Small or netless copper shapes (teardrops, artwork), in the pictures only: 139 on Top Layer, 63 on Bottom Layer, 17 on GND

## Text on the board
Bottom Silkscreen Layer: TX | OFF | ON | Loongson | o
